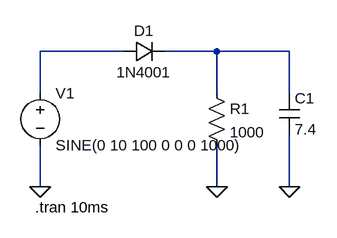
[diagram p0: schematic Half Wave Rectifier with Capacitor.asc]
Half Wave Rectifier with Capacitor.asc, the LTspice schematic file:
Version 4
SHEET 1 880 680
WIRE 176 64 48 64
WIRE 320 64 240 64
WIRE 432 64 320 64
WIRE 48 128 48 64
WIRE 320 128 320 64
WIRE 432 128 432 64
WIRE 48 272 48 208
WIRE 320 272 320 208
WIRE 432 272 432 192
FLAG 48 272 0
FLAG 320 272 0
FLAG 432 272 0
SYMBOL voltage 48 112 R0
WINDOW 123 0 0 Left 0
WINDOW 39 0 0 Left 0
SYMATTR InstName V1
SYMATTR Value SINE(0 10 100 0 0 0 1000)
SYMBOL diode 176 80 R270
WINDOW 0 32 32 VTop 2
WINDOW 3 0 32 VBottom 2
SYMATTR InstName D1
SYMATTR Value 1N4001
SYMBOL res 304 112 R0
SYMATTR InstName R1
SYMATTR Value 1000
SYMBOL cap 416 128 R0
SYMATTR InstName C1
SYMATTR Value 7.4
TEXT 40 304 Left 2 !.tran 10ms

The netlist it stands for:
* Half Wave Rectifier with Capacitor.asc
V1 N001 0 SINE(0 10 100 0 0 0 1000)
D1 N001 N002 1N4001
R1 N002 0 1000
C1 N002 0 7.4
.model D D
.lib standard.dio
.tran 10ms
.backanno
.end